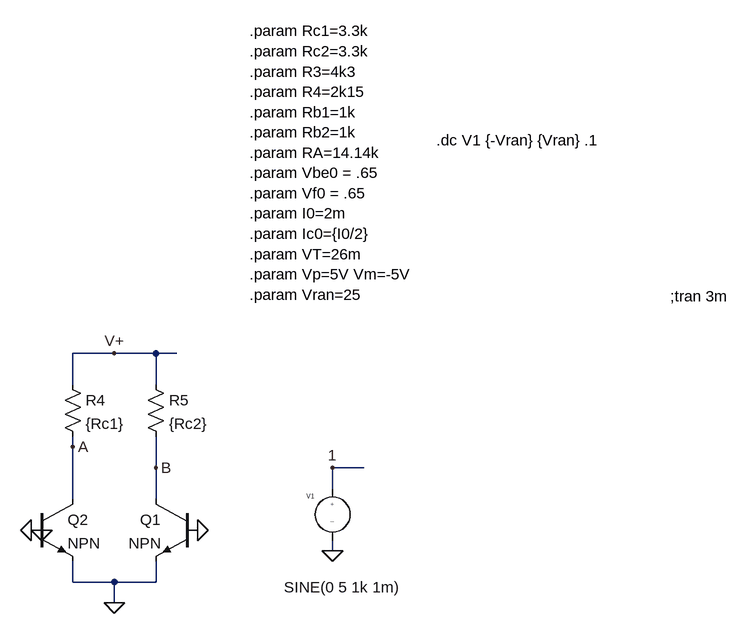
[diagram p0: schematic Draft1.asc]
Draft1.asc, the LTspice schematic file:
Version 4
SHEET 1 880 680
WIRE -368 16 -432 16
WIRE -304 16 -368 16
WIRE -272 16 -304 16
WIRE -432 64 -432 16
WIRE -304 64 -304 16
WIRE -432 160 -432 144
WIRE -304 192 -304 144
WIRE 16 192 -32 192
WIRE -32 224 -32 192
WIRE -432 240 -432 160
WIRE -304 240 -304 192
WIRE -32 320 -32 304
WIRE -432 368 -432 336
WIRE -368 368 -432 368
WIRE -304 368 -304 336
WIRE -304 368 -368 368
WIRE -368 400 -368 368
FLAG -32 320 0
FLAG -32 192 1
FLAG -432 160 A
FLAG -304 192 B
FLAG -368 16 V+
FLAG -240 288 0
FLAG -480 288 0
FLAG -496 288 0
FLAG -368 400 0
SYMBOL MDB_sym\\source-V -32 208 M0
WINDOW 123 0 0 Left 2
WINDOW 39 0 0 Left 2
WINDOW 3 -104 168 Left 2
SYMATTR InstName V1
SYMATTR Value SINE(0 5 1k 1m)
SYMBOL EIT_Semiconductors\\npn -240 240 M0
SYMATTR InstName Q1
SYMBOL res -448 48 R0
SYMATTR InstName R4
SYMATTR Value {Rc1}
SYMBOL res -320 48 R0
SYMATTR InstName R5
SYMATTR Value {Rc2}
SYMBOL EIT_Semiconductors\\npn -496 240 R0
SYMATTR InstName Q2
TEXT -160 -480 Left 2 !.param Rc1=3.3k\n.param Rc2=3.3k\n.param R3=4k3\n.param R4=2k15\n.param Rb1=1k\n.param Rb2=1k\n.param RA=14.14k\n.param Vbe0 = .65\n.param Vf0 = .65\n.param I0=2m\n.param Ic0={I0/2}\n.param VT=26m\n.param Vp=5V Vm=-5V\n.param Vran=25
TEXT 128 -312 Left 2 !.dc V1 {-Vran} {Vran} .1
TEXT 488 -72 Left 2 !;tran 3m

The netlist it stands for:
* Draft1.asc
V1 1 0 SINE(0 5 1k 1m)
Q1 B 0 0 0 NPN
R4 V+ A {Rc1}
R5 V+ B {Rc2}
Q2 A 0 0 0 NPN
.model NPN NPN
.model PNP PNP
.lib standard.bjt
.param Rc1=3.3k
.param Rc2=3.3k
.param R3=4k3
.param R4=2k15
.param Rb1=1k
.param Rb2=1k
.param RA=14.14k
.param Vbe0 = .65
.param Vf0 = .65
.param I0=2m
.param Ic0={I0/2}
.param VT=26m
.param Vp=5V Vm=-5V
.param Vran=25
.dc V1 {-Vran} {Vran} .1
;tran 3m
.backanno
.end